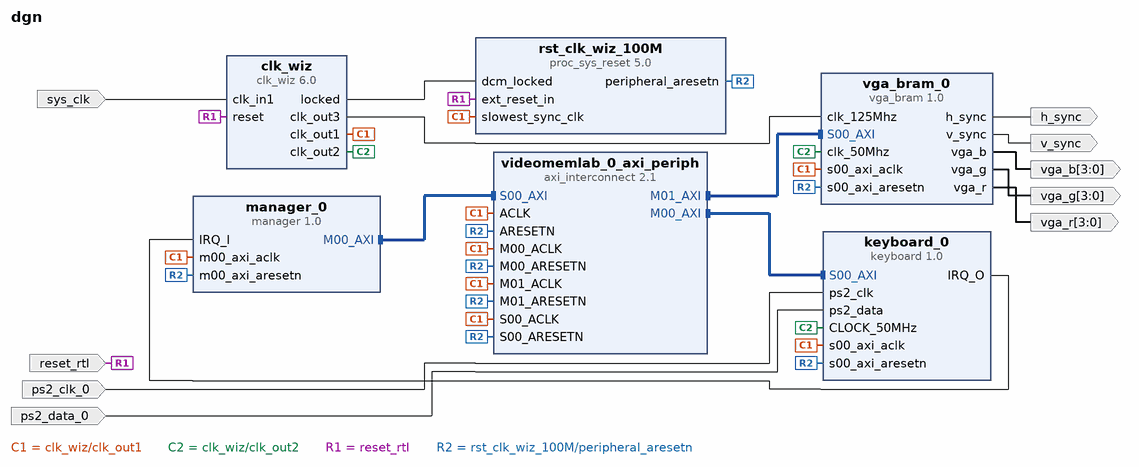
[diagram p0: block diagram of the top level]
# Vivado block design dgn, xc7z010clg400-1, Vivado 2019.1
create_bd_design dgn

create_bd_port -dir I ps2_clk_0
create_bd_port -dir I ps2_data_0
create_bd_port -dir O h_sync
create_bd_port -dir I -type rst reset_rtl
set_property -dict {CONFIG.POLARITY ACTIVE_HIGH} [get_bd_ports reset_rtl]
create_bd_port -dir I -type clk sys_clk
set_property -dict {CONFIG.FREQ_HZ 125000000} [get_bd_ports sys_clk]
create_bd_port -dir O -from 3 -to 0 vga_b
create_bd_port -dir O -from 3 -to 0 vga_g
create_bd_port -dir O -from 3 -to 0 vga_r
create_bd_port -dir O v_sync

create_bd_cell -type ip -vlnv xilinx.com:ip:clk_wiz:6.0 clk_wiz
set_property -dict [list \
  CONFIG.CLKIN1_JITTER_PS 80.0 \
  CONFIG.CLKOUT1_JITTER 124.615 \
  CONFIG.CLKOUT1_PHASE_ERROR 96.948 \
  CONFIG.CLKOUT2_JITTER 143.688 \
  CONFIG.CLKOUT2_PHASE_ERROR 96.948 \
  CONFIG.CLKOUT2_REQUESTED_OUT_FREQ 50.000 \
  CONFIG.CLKOUT2_USED true \
  CONFIG.CLKOUT3_JITTER 119.348 \
  CONFIG.CLKOUT3_PHASE_ERROR 96.948 \
  CONFIG.CLKOUT3_REQUESTED_OUT_FREQ 125.000 \
  CONFIG.CLKOUT3_USED true \
  CONFIG.MMCM_CLKFBOUT_MULT_F 8.000 \
  CONFIG.MMCM_CLKIN1_PERIOD 8.000 \
  CONFIG.MMCM_CLKOUT1_DIVIDE 20 \
  CONFIG.MMCM_CLKOUT2_DIVIDE 8 \
  CONFIG.NUM_OUT_CLKS 3 \
  CONFIG.PRIM_IN_FREQ 125.000 \
] [get_bd_cells clk_wiz]
create_bd_cell -type ip -vlnv clarkson.edu:user:keyboard:1.0 keyboard_0
create_bd_cell -type ip -vlnv clarkson.edu:user:manager:1.0 manager_0
set_property -dict [list \
  CONFIG.C_M00_PS2_SLAVE_BASE_ADDR 0x80000000 \
  CONFIG.C_M00_VIDEOMEM_BASE_ADDR 0x40000000 \
] [get_bd_cells manager_0]
create_bd_cell -type ip -vlnv xilinx.com:ip:proc_sys_reset:5.0 rst_clk_wiz_100M
set_property -dict {CONFIG.C_EXT_RST_WIDTH 1} [get_bd_cells rst_clk_wiz_100M]
create_bd_cell -type ip -vlnv clarkson.edu:user:vga_bram:1.0 vga_bram_0
create_bd_cell -type ip -vlnv xilinx.com:ip:axi_interconnect:2.1 videomemlab_0_axi_periph
set_property -dict {CONFIG.NUM_MI 2} [get_bd_cells videomemlab_0_axi_periph]

# ---- connections ----

connect_bd_intf_net [get_bd_intf_pins manager_0/M00_AXI] [get_bd_intf_pins videomemlab_0_axi_periph/S00_AXI]
connect_bd_intf_net [get_bd_intf_pins keyboard_0/S00_AXI] [get_bd_intf_pins videomemlab_0_axi_periph/M00_AXI]
connect_bd_intf_net [get_bd_intf_pins vga_bram_0/S00_AXI] [get_bd_intf_pins videomemlab_0_axi_periph/M01_AXI]
connect_bd_net [get_bd_ports ps2_clk_0] [get_bd_pins keyboard_0/ps2_clk]
connect_bd_net [get_bd_ports ps2_data_0] [get_bd_pins keyboard_0/ps2_data]
connect_bd_net [get_bd_pins clk_wiz/clk_out1] \
  [get_bd_pins keyboard_0/s00_axi_aclk] [get_bd_pins manager_0/m00_axi_aclk] [get_bd_pins rst_clk_wiz_100M/slowest_sync_clk] \
  [get_bd_pins vga_bram_0/s00_axi_aclk] [get_bd_pins videomemlab_0_axi_periph/ACLK] \
  [get_bd_pins videomemlab_0_axi_periph/M00_ACLK] [get_bd_pins videomemlab_0_axi_periph/M01_ACLK] \
  [get_bd_pins videomemlab_0_axi_periph/S00_ACLK]
connect_bd_net [get_bd_pins clk_wiz/clk_out2] [get_bd_pins keyboard_0/CLOCK_50MHz] [get_bd_pins vga_bram_0/clk_50Mhz]
connect_bd_net [get_bd_pins clk_wiz/clk_out3] [get_bd_pins vga_bram_0/clk_125Mhz]
connect_bd_net [get_bd_pins clk_wiz/locked] [get_bd_pins rst_clk_wiz_100M/dcm_locked]
connect_bd_net [get_bd_pins keyboard_0/IRQ_O] [get_bd_pins manager_0/IRQ_I]
connect_bd_net [get_bd_ports reset_rtl] [get_bd_pins clk_wiz/reset] [get_bd_pins rst_clk_wiz_100M/ext_reset_in]
connect_bd_net [get_bd_pins rst_clk_wiz_100M/peripheral_aresetn] \
  [get_bd_pins keyboard_0/s00_axi_aresetn] [get_bd_pins manager_0/m00_axi_aresetn] [get_bd_pins vga_bram_0/s00_axi_aresetn] \
  [get_bd_pins videomemlab_0_axi_periph/ARESETN] [get_bd_pins videomemlab_0_axi_periph/M00_ARESETN] \
  [get_bd_pins videomemlab_0_axi_periph/M01_ARESETN] [get_bd_pins videomemlab_0_axi_periph/S00_ARESETN]
connect_bd_net -net sys_clock_1 [get_bd_ports sys_clk] [get_bd_pins clk_wiz/clk_in1]
connect_bd_net -net vga_bram_0_hsync [get_bd_pins vga_bram_0/h_sync] [get_bd_ports h_sync]
connect_bd_net [get_bd_pins vga_bram_0/vga_b] [get_bd_ports vga_b]
connect_bd_net [get_bd_pins vga_bram_0/vga_g] [get_bd_ports vga_g]
connect_bd_net [get_bd_pins vga_bram_0/vga_r] [get_bd_ports vga_r]
connect_bd_net -net vga_bram_0_vsync [get_bd_pins vga_bram_0/v_sync] [get_bd_ports v_sync]

# ---- address map ----
assign_bd_address -offset 0x40000000 -range 64K -target_address_space [get_bd_addr_spaces manager_0/M00_AXI] [get_bd_addr_segs vga_bram_0/S00_AXI/S00_AXI_reg]
assign_bd_address -offset 0x80000000 -range 64K -target_address_space [get_bd_addr_spaces manager_0/M00_AXI] [get_bd_addr_segs keyboard_0/S00_AXI/S00_AXI_reg]

validate_bd_design
save_bd_design
